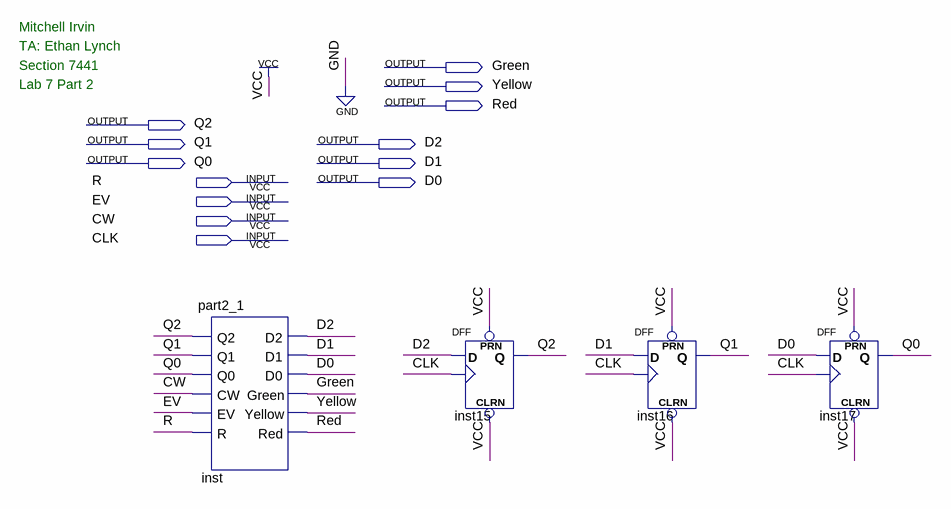
[diagram p0: schematic sheet]
// Quartus schematic part2_2.bdf as structural Verilog: 4 symbols, 13 pins
module part2_2 (
  input  R,
  input  EV,
  input  CW,
  input  CLK,
  output Green,
  output Yellow,
  output Red,
  output Q2,
  output Q1,
  output D2,
  output Q0,
  output D1,
  output D0
);

  part2_1 inst (
    .Q2(Q2), .Q1(Q1), .Q0(Q0), .CW(CW), .EV(EV), .R(R), .D2(D2), .D1(D1), .D0(D0), .Green(Green),
    .Yellow(Yellow), .Red(Red));
  DFF inst15 (.CLRN(1'b1), .CLK(CLK), .D(D2), .PRN(1'b1), .Q(Q2));
  DFF inst16 (.CLRN(1'b1), .CLK(CLK), .D(D1), .PRN(1'b1), .Q(Q1));
  DFF inst17 (.CLRN(1'b1), .CLK(CLK), .D(D0), .PRN(1'b1), .Q(Q0));

  // Notes on the sheet:
  //   Mitchell Irvin
  //   TA: Ethan Lynch
  //   Section 7441
  //   Lab 7 Part 2
endmodule
